# EAGLE schematic STM32-Schematic-Design (EAGLE 9.6.2)

## Sheet 1 of 2
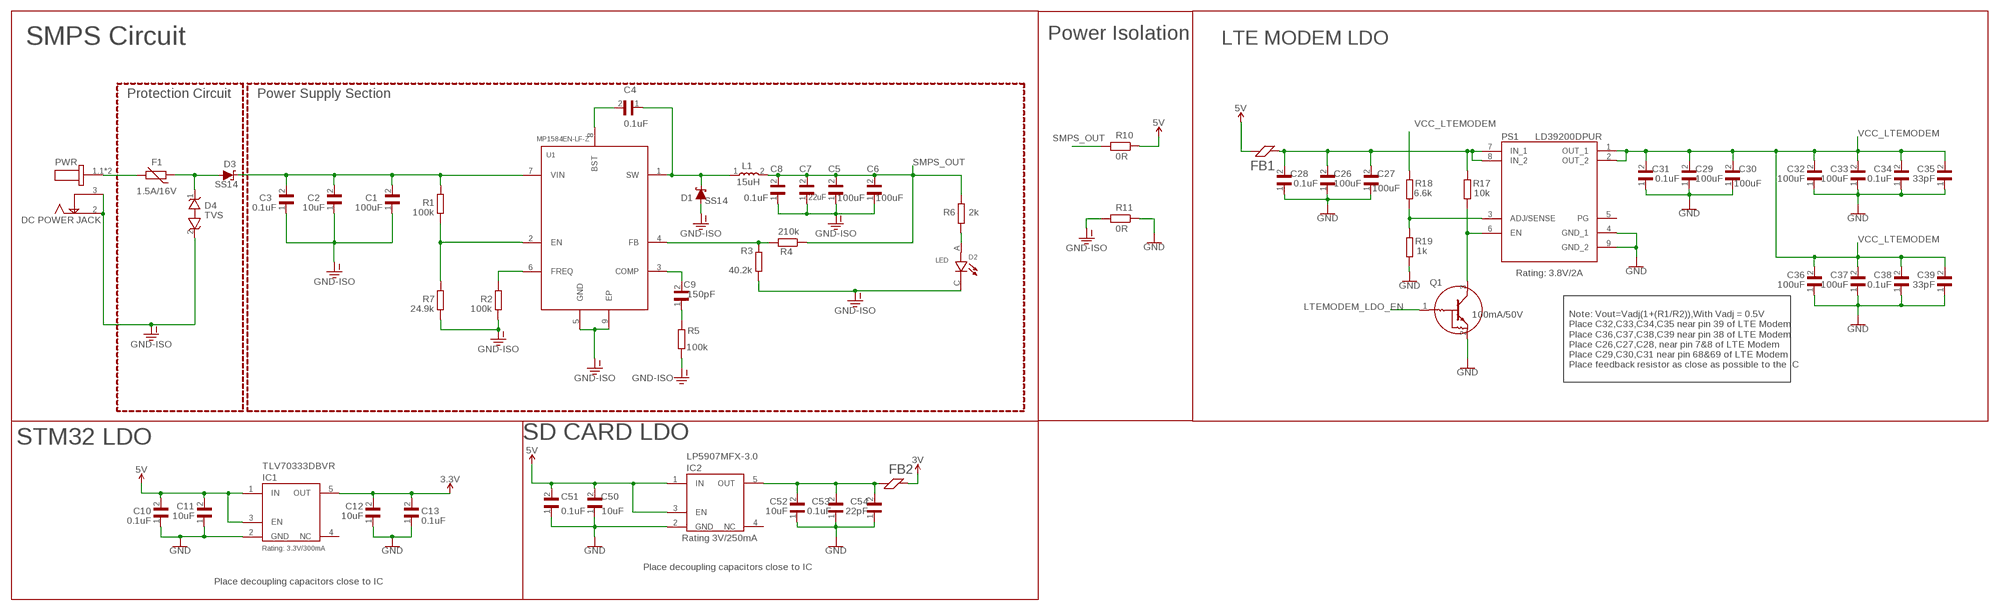
[diagram p0: schematic, sheet 1]

### Parts
C1  100uF  GRM31CR61A107ME05L  [CAPC3216X190N]
C2  10uF  CAPACITOR  [C0603]
C3  0.1uF  CAPACITOR  [C0603]
C4  0.1uF  CAPACITOR  [C0603]
C5  100uF  GRM31CR61A107ME05L  [CAPC3216X190N]
C6  100uF  GRM31CR61A107ME05L  [CAPC3216X190N]
C7  22uF  CAPACITOR  [C0603]
C8  0.1uF  CAPACITOR  [C0603]
C9  150pF  CAPACITOR  [C0603]
C10  0.1uF  CAPACITOR  [C0603]
C11  10uF  CAPACITOR  [C0603]
C12  10uF  CAPACITOR  [C0603]
C13  0.1uF  CAPACITOR  [C0603]
C26  100uF  GRM31CR61A107ME05L  [CAPC3216X190N]
C27  100uF  GRM31CR61A107ME05L  [CAPC3216X190N]
C28  0.1uF  CAPACITOR  [C0603]
C29  100uF  GRM31CR61A107ME05L  [CAPC3216X190N]
C30  100uF  GRM31CR61A107ME05L  [CAPC3216X190N]
C31  0.1uF  CAPACITOR  [C0603]
C32  100uF  GRM31CR61A107ME05L  [CAPC3216X190N]
C33  100uF  GRM31CR61A107ME05L  [CAPC3216X190N]
C34  0.1uF  CAPACITOR  [C0603]
C35  33pF  CAPACITOR  [C0603]
C36  100uF  GRM31CR61A107ME05L  [CAPC3216X190N]
C37  100uF  GRM31CR61A107ME05L  [CAPC3216X190N]
C38  0.1uF  CAPACITOR  [C0603]
C39  33pF  CAPACITOR  [C0603]
C50  10uF  CAPACITOR  [C0603]
C51  0.1uF  CAPACITOR  [C0603]
C52  10uF  CAPACITOR  [C0603]
C53  0.1uF  CAPACITOR  [C0603]
C54  22pF  CAPACITOR  [C0603]
D1  SS14  DIODE-SCHOTTKY-SS14  [SMA-DIODE]
D2  LED  LTW-C191TLA  [LEDC1608X65N]
D3  SS14  DIODE-SCHOTTKY-SS14  [SMA-DIODE]
D4  TVS  SMBJ12CA  [DIONM5436X245N]
F1  1.5A/16V  MINISMDC150F/24-2  [FUSC4632X194N]
FB2  BLM18AG601SZ1D  [BEADC1608X95N]
FL3  FB1  BLM18AG601SZ1D  [BEADC1608X95N]
IC1  TLV70333DBVR  [SOT95P280X145-5N]
IC2  LP5907MFX-3.0  TLV70333DBVR  [SOT95P280X145-5N]
L1  15uH  ASPI-0630LR-150M-T15  [INDPM7266X300N]
PS1  LD39200DPUR  [SON80P400X400X100-9N]
PWR  DC POWER JACK  DCJ200-05-A-XX-X_REVA  [GCT_DCJ200-05-A-XX-X_REVA]
Q1  100mA/50V  DTC143ZET1G  [SOT50P160X90-3N]
R1  100k  RESISTOR  [R0603]
R2  100k  RESISTOR  [R0603]
R3  40.2k  RESISTOR  [R0603]
R4  210k  RESISTOR  [R0603]
R5  100k  RESISTOR  [R0603]
R6  2k  RESISTOR  [R0603]
R7  24.9k  RESISTOR  [R0603]
R10  0R  RC0805FR-7W1K5L  [RESC2012X60]
R11  0R  RC0805FR-7W1K5L  [RESC2012X60]
R17  10k  RESISTOR  [R0603]
R18  6.6k  RESISTOR  [R0603]
R19  1k  RESISTOR  [R0603]
U1  MP1584EN-LF-Z  [SOIC127P600X170-9N]

### Nets
3.3V: C12.2 C13.2 IC1.5(OUT) ; also sheet 2
3V: FB2.2 ; also sheet 2
5V: C10.2 C11.2 C50.2 C51.2 FL3.1 IC1.1(IN) IC1.3(EN) IC2.1(IN) IC2.3(EN) R10.2
GND: C10.1 C11.1 C12.1 C13.1 C26.1 C27.1 C28.1 C29.1 C30.1 C31.1 C32.1 C33.1 C34.1 C35.1 C36.1 C37.1 C38.1 C39.1 C50.1 C51.1 C52.1 C53.1 C54.1 IC1.2(GND) IC2.2(GND) PS1.4(GND_1) PS1.9(GND_2) Q1.2(E) R11.2 R19.1 ; also sheet 2
GND-ISO: C1.1 C2.1 C3.1 C5.1 C6.1 C7.1 C8.1 D1.A D2.C D4.2 PWR.2 PWR.3 R2.1 R3.1 R5.2 R7.1 R11.1 U1.5(GND) U1.9(EP)
LTEMODEM_LDO_EN: Q1.1(B) ; also sheet 2
N$2: R1.1 R7.2 U1.2(EN)
N$3: D3.A D4.1 F1.1
N$4: R2.2 U1.6(FREQ)
N$6: C4.2 U1.8(BST)
N$7: C4.1 D1.C L1.1 U1.1(SW)
N$8: R3.2 R4.2 U1.4(FB)
N$9: C9.2 U1.3(COMP)
N$10: C9.1 R5.1
N$11: D2.A R6.1
N$12: F1.2 PWR.1.1 PWR.1.2
N$70: PS1.6(EN) Q1.3(C) R17.1
N$71: PS1.3(ADJ/SENSE) R18.1 R19.2
N$72: C52.2 C53.2 C54.2 FB2.1 IC2.5(OUT)
N$73: C26.2 C27.2 C28.2 FL3.2 PS1.7(IN_1) PS1.8(IN_2) R17.2
SMPS_IN: C1.2 C2.2 C3.2 D3.C R1.2 U1.7(VIN)
SMPS_OUT: C5.2 C6.2 C7.2 C8.2 L1.2 R4.1 R6.2 R10.1
VCC_LTEMODEM: C29.2 C30.2 C31.2 C32.2 C33.2 C34.2 C35.2 C36.2 C37.2 C38.2 C39.2 PS1.1(OUT_1) PS1.2(OUT_2) R18.2 ; also sheet 2
Unconnected: IC1.4(NC) IC2.4(NC) PS1.5(PG)

### Notes on the sheet
- SMPS Circuit | Power Isolation | LTE MODEM LDO
- Protection Circuit | Power Supply Section
- Rating: 3.8V/2A
- Note: Vout=Vadj(1+(R1/R2)),With Vadj = 0.5V
  Place C32,C33,C34,C35 near pin 39 of LTE Modem
  Place C36,C37,C38,C39 near pin 38 of LTE Modem
  Place C26,C27,C28, near pin 7&8 of LTE Modem
  Place C29,C30,C31 near pin 68&69 of LTE Modem
  Place feedback resistor as close as possible to the IC
- STM32 LDO | SD CARD LDO
- Rating 3V/250mA
- Rating: 3.3V/300mA
- Place decoupling capacitors close to IC
- Place decoupling capacitors close to IC

## Sheet 2 of 2
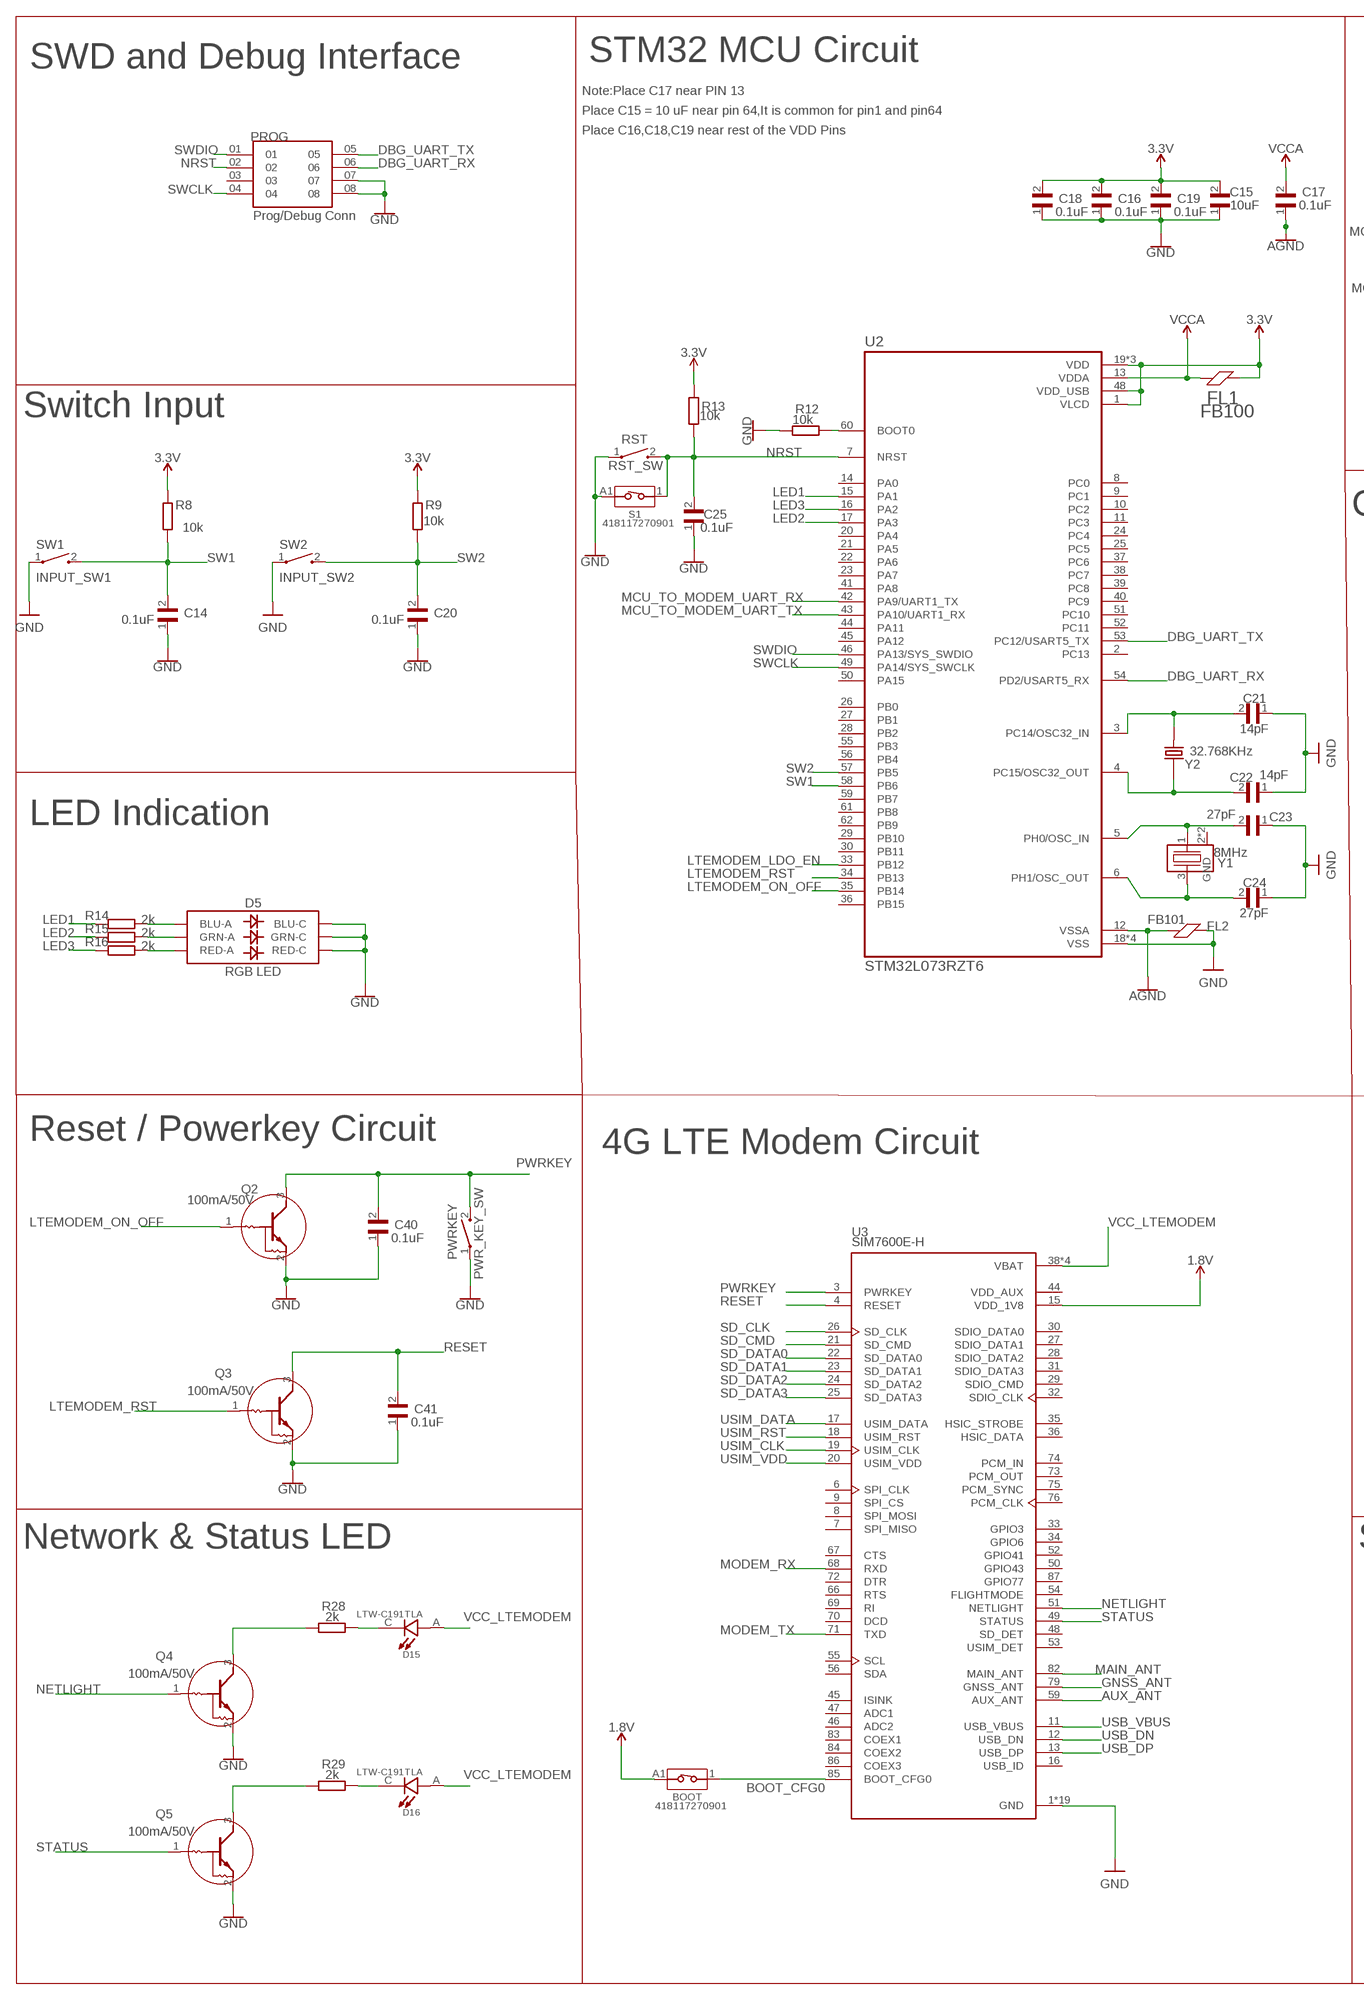
[diagram p1: schematic, sheet 2, part 1 of 2]
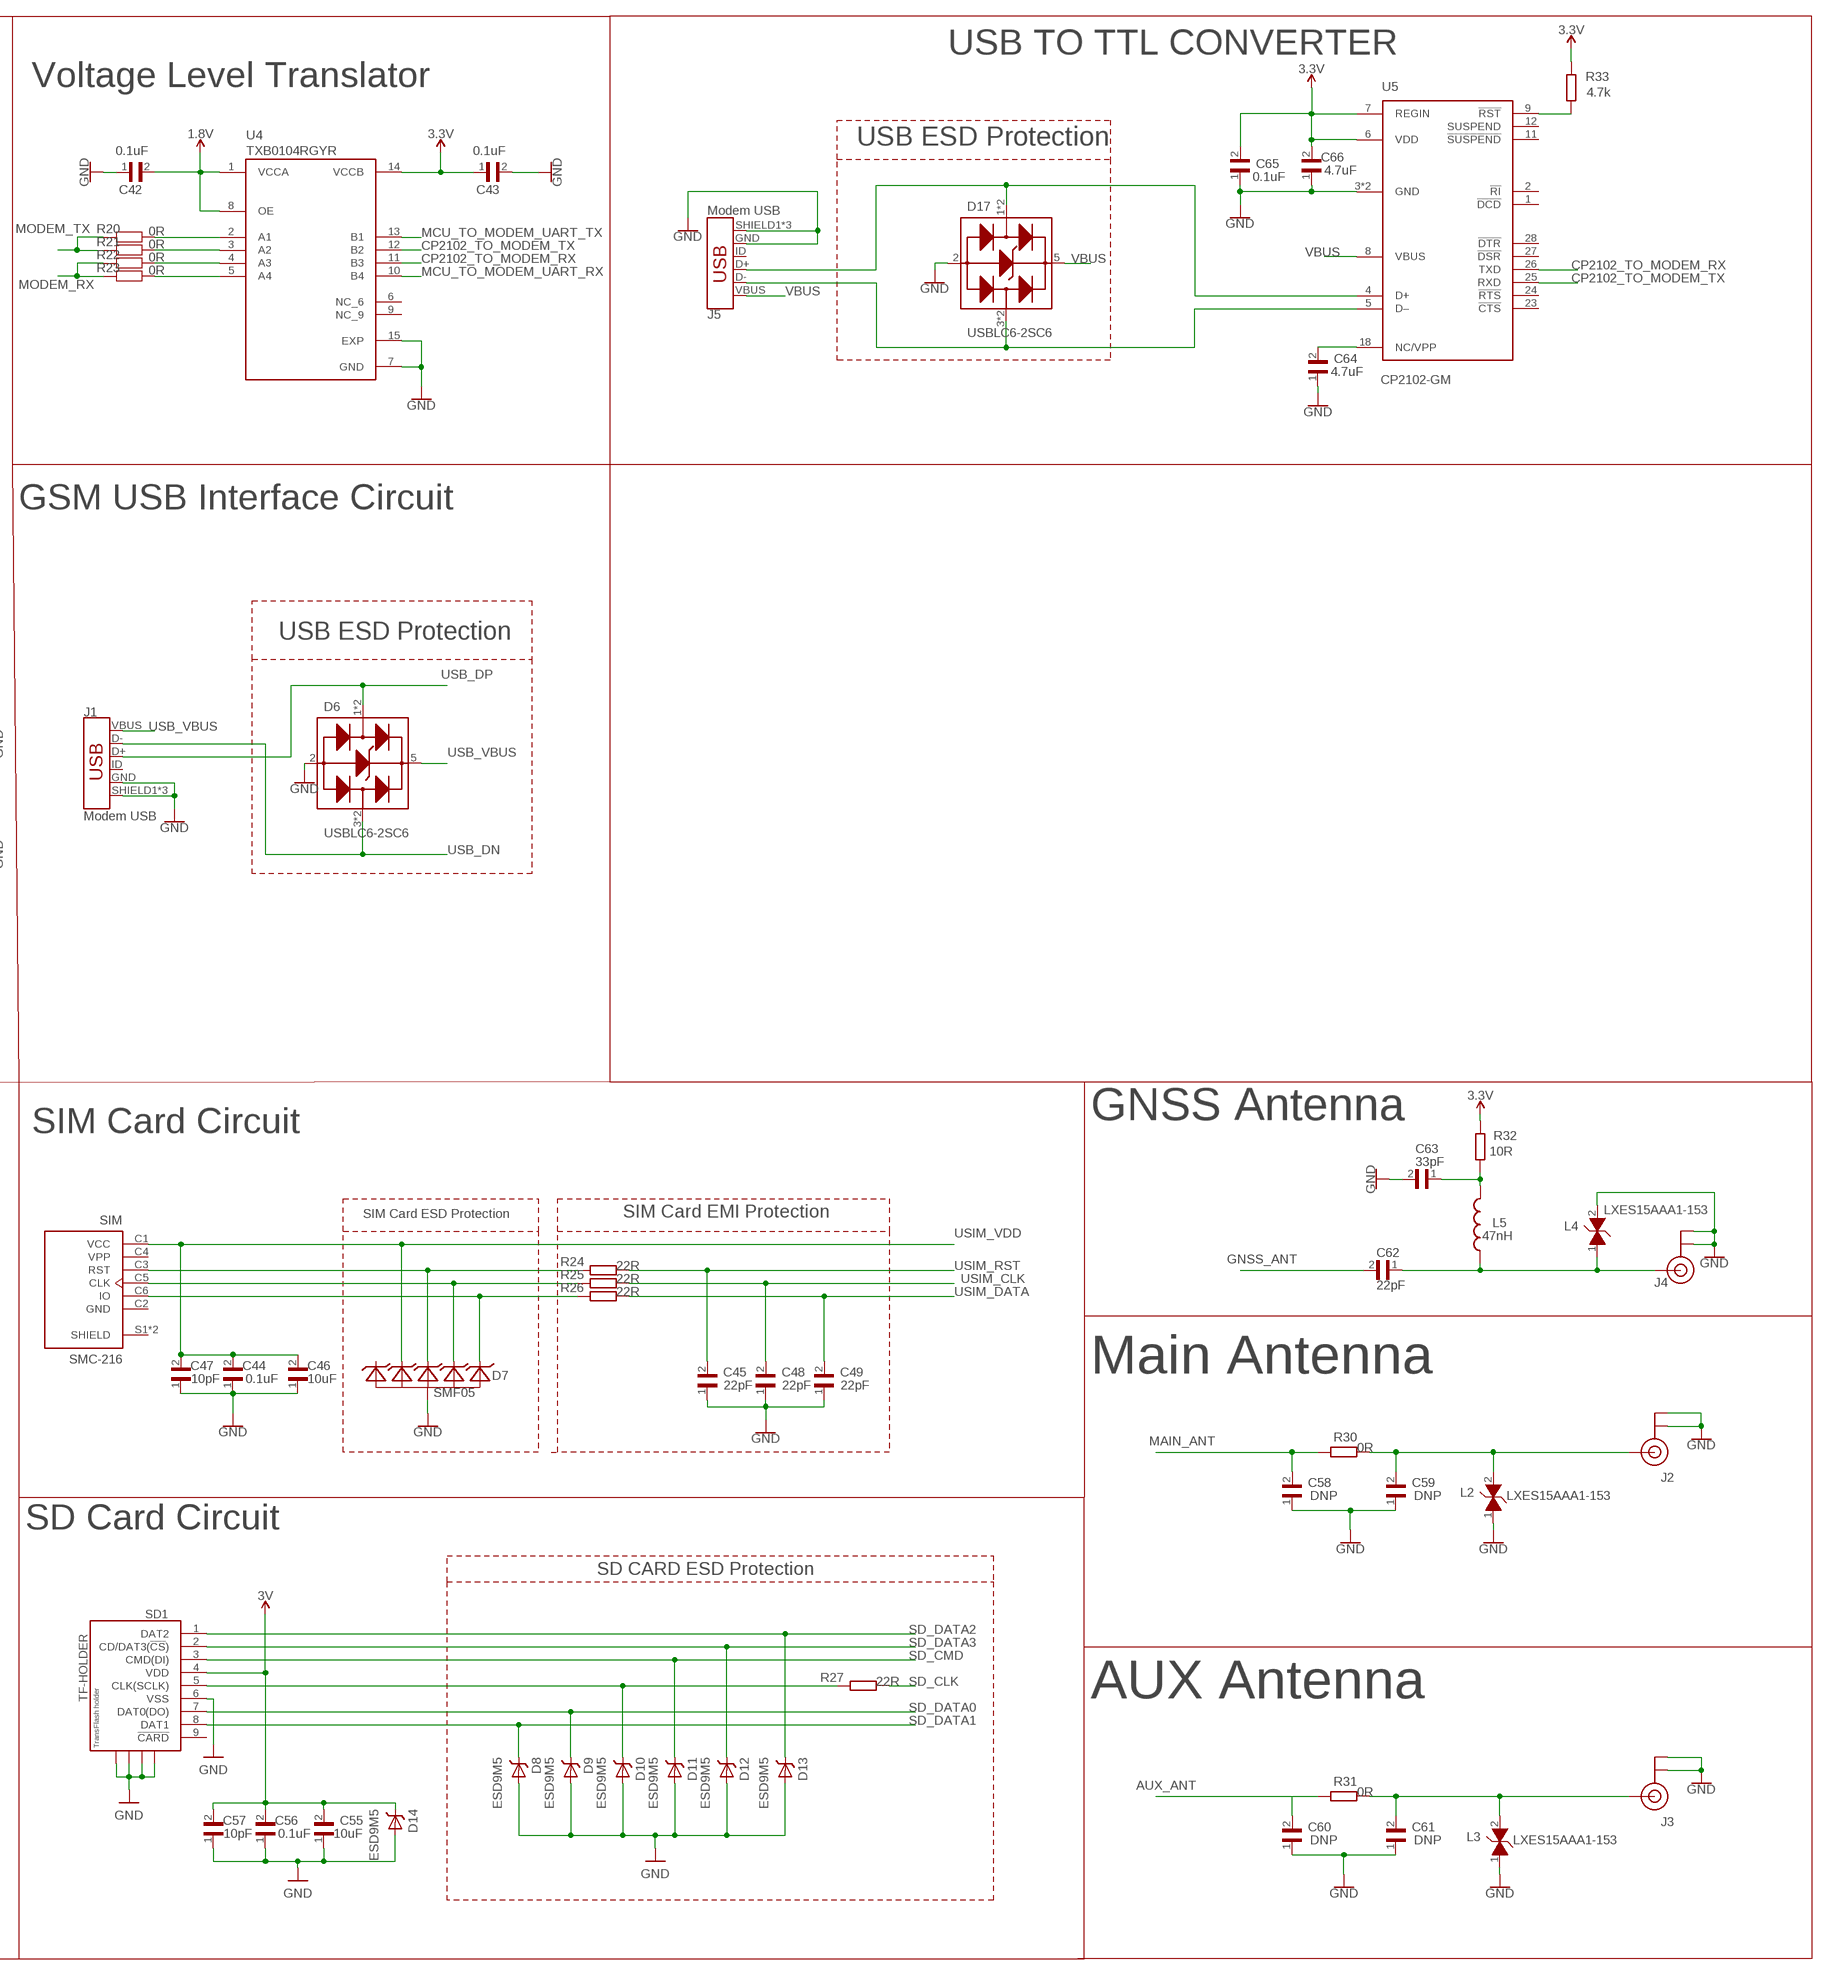
[diagram p2: schematic, sheet 2, part 2 of 2]

### Parts
BOOT  418117270901  [418117270901]
C14  0.1uF  CAPACITOR  [C0603]
C15  10uF  CAPACITOR  [C0603]
C16  0.1uF  CAPACITOR  [C0603]
C17  0.1uF  CAPACITOR  [C0603]
C18  0.1uF  CAPACITOR  [C0603]
C19  0.1uF  CAPACITOR  [C0603]
C20  0.1uF  CAPACITOR  [C0603]
C21  14pF  CAPACITOR  [C0603]
C22  14pF  CAPACITOR  [C0603]
C23  27pF  CAPACITOR  [C0603]
C24  27pF  CAPACITOR  [C0603]
C25  0.1uF  CAPACITOR  [C0603]
C40  0.1uF  CAPACITOR  [C0603]
C41  0.1uF  CAPACITOR  [C0603]
C42  0.1uF  CAPACITOR  [C0603]
C43  0.1uF  CAPACITOR  [C0603]
C44  0.1uF  CAPACITOR  [C0603]
C45  22pF  CAPACITOR  [C0603]
C46  10uF  CAPACITOR  [C0603]
C47  10pF  CAPACITOR  [C0603]
C48  22pF  CAPACITOR  [C0603]
C49  22pF  CAPACITOR  [C0603]
C55  10uF  CAPACITOR  [C0603]
C56  0.1uF  CAPACITOR  [C0603]
C57  10pF  CAPACITOR  [C0603]
C58  DNP  CAPACITOR  [C0603]
C59  DNP  CAPACITOR  [C0603]
C60  DNP  CAPACITOR  [C0603]
C61  DNP  CAPACITOR  [C0603]
C62  22pF  CAPACITOR  [C0603]
C63  33pF  CAPACITOR  [C0603]
C64  4.7uF  CAPACITOR  [C0603]
C65  0.1uF  CAPACITOR  [C0603]
C66  4.7uF  CAPACITOR  [C0603]
D5  RGB LED  LED-RGBNO_IC  [LED-TRICOLOR-5050]
D6  USBLC6-2SC6  [SOT95P280X145-6N]
D7  SMF05  SMF05C.TCT  [SC70-6]
D8  ESD9M5  ESD9M5.0ST5G  [SODFL1060X40N]
D9  ESD9M5  ESD9M5.0ST5G  [SODFL1060X40N]
D10  ESD9M5  ESD9M5.0ST5G  [SODFL1060X40N]
D11  ESD9M5  ESD9M5.0ST5G  [SODFL1060X40N]
D12  ESD9M5  ESD9M5.0ST5G  [SODFL1060X40N]
D13  ESD9M5  ESD9M5.0ST5G  [SODFL1060X40N]
D14  ESD9M5  ESD9M5.0ST5G  [SODFL1060X40N]
D15  LTW-C191TLA  [LEDC1608X65N]
D16  LTW-C191TLA  [LEDC1608X65N]
D17  USBLC6-2SC6  [SOT95P280X145-6N]
FL1  FB100  BLM18AG601SZ1D  [BEADC1608X95N]
FL2  FB101  BLM18AG601SZ1D  [BEADC1608X95N]
J1  Modem USB  USB_MICRO-B_FEMALE-SMT  [USB-B-MICRO-SMD]
J2  U.FL  [U.FL]
J3  U.FL  [U.FL]
J4  U.FL  [U.FL]
J5  Modem USB  USB_MICRO-B_FEMALE-SMT  [USB-B-MICRO-SMD]
L2  LXES15AAA1-153  [INDC1005X45]
L3  LXES15AAA1-153  [INDC1005X45]
L4  LXES15AAA1-153  [INDC1005X45]
L5  47nH  AIML-0603-47NK-T  [INDC1608X95N]
PROG  Prog/Debug Conn  TSM-104-02-S-DV-P  [SAMTEC_TSM-104-02-S-DV-P]
PWRKEY  PWR_KEY_SW  1437566-3  [SW_1437566-3]
Q2  100mA/50V  DTC143ZET1G  [SOT50P160X90-3N]
Q3  100mA/50V  DTC143ZET1G  [SOT50P160X90-3N]
Q4  100mA/50V  DTC143ZET1G  [SOT50P160X90-3N]
Q5  100mA/50V  DTC143ZET1G  [SOT50P160X90-3N]
R8  10k  RESISTOR  [R0603]
R9  10k  RESISTOR  [R0603]
R12  10k  RESISTOR  [R0603]
R13  10k  RESISTOR  [R0603]
R14  2k  RESISTOR  [R0603]
R15  2k  RESISTOR  [R0603]
R16  2k  RESISTOR  [R0603]
R20  0R  RC0402FR-071KL  [RESC1005X40]
R21  0R  RC0402FR-071KL  [RESC1005X40]
R22  0R  RC0402FR-071KL  [RESC1005X40]
R23  0R  RC0402FR-071KL  [RESC1005X40]
R24  22R  RESISTOR  [R0603]
R25  22R  RESISTOR  [R0603]
R26  22R  RESISTOR  [R0603]
R27  22R  RESISTOR  [R0603]
R28  2k  RESISTOR  [R0603]
R29  2k  RESISTOR  [R0603]
R30  0R  RESISTOR  [R0603]
R31  0R  RESISTOR  [R0603]
R32  10R  RESISTOR  [R0603]
R33  4.7k  RESISTOR  [R0603]
RST  RST_SW  1437566-3  [SW_1437566-3]
S1  418117270901  [418117270901]
SD1  TF-HOLDER  [TF-PULL]
SIM  SMC-216  [XUNPU_SMC-216]
SW1  INPUT_SW1  1437566-3  [SW_1437566-3]
SW2  INPUT_SW2  1437566-3  [SW_1437566-3]
U2  STM32L073RZT6  [QFP50P1200X1200X160-64N]
U3  SIM7600E-H  [IC_SIM7600E-H]
U4  TXB0104RGYR  [QFN50P350X350X100-15N]
U5  CP2102-GM  [QFN50P500X500X100-29N]
Y1  8MHz  ABMM2-8.000MHZ-E2-T  [XTAL_ABMM2-8.000MHZ-E2-T]
Y2  32.768KHz  ABS07-32.768KHZ-T  [XTAL_ABS07-32.768KHZ-T]

### Nets
1.8V: BOOT.A1 C42.2 U3.15(VDD_1V8) U4.1(VCCA) U4.8(OE)
3.3V: C15.2 C16.2 C18.2 C19.2 C43.1 C65.2 C66.2 FL1.2 R8.1 R9.1 R13.1 R32.2 R33.1 U2.1(VLCD) U2.19(VDD) U2.32(VDD) U2.48(VDD_USB) U2.64(VDD) U4.14(VCCB) U5.6(VDD) U5.7(REGIN) ; also sheet 1
3V: C55.2 C56.2 C57.2 D14.1 SD1.4(VDD) ; also sheet 1
AGND: C17.1 FL2.1 U2.12(VSSA)
AUX_ANT: C60.2 R31.1 U3.59(AUX_ANT)
BOOT_CFG0: BOOT.1 U3.85(BOOT_CFG0)
CP2102_TO_MODEM_RX: U4.11(B3) U5.26(TXD)
CP2102_TO_MODEM_TX: U4.12(B2) U5.25(RXD)
DBG_UART_RX: PROG.06 U2.54(PD2/USART5_RX)
DBG_UART_TX: PROG.05 U2.53(PC12/USART5_TX)
GND: C14.1 C15.1 C16.1 C18.1 C19.1 C20.1 C21.1 C22.1 C23.1 C24.1 C25.1 C40.1 C41.1 C42.1 C43.2 C44.1 C45.1 C46.1 C47.1 C48.1 C49.1 C55.1 C56.1 C57.1 C58.1 C59.1 C60.1 C61.1 C63.2 C64.1 C65.1 C66.1 D5.4(BLU-C) D5.5(RED-C) D5.6(GRN-C) D6.2(GND) D7.2(A) D8.2 D9.2 D10.2 D11.2 D12.2 D13.2 D14.2 D17.2(GND) FL2.2 J1.GND J1.SHIELD1(SHIELD) J1.SHIELD2(SHIELD) J1.SHIELD3(SHIELD) J2.1(GND) J2.2(GND) J3.1(GND) J3.2(GND) J4.1(GND) J4.2(GND) J5.GND J5.SHIELD1(SHIELD) J5.SHIELD2(SHIELD) J5.SHIELD3(SHIELD) L2.1 L3.1 L4.2 PROG.07 PROG.08 PWRKEY.1 Q2.2(E) Q3.2(E) Q4.2(E) Q5.2(E) R12.1 RST.1 S1.A1 SD1.6(VSS) SD1.S1 SD1.S2 SD1.S3 SD1.S4 SW1.1 SW2.1 U2.18(VSS) U2.31(VSS) U2.47(VSS) U2.63(VSS) U3.1(GND) U3.2(GND) U3.5(GND) U3.10(GND) U3.14(GND) U3.37(GND) U3.40(GND) U3.41(GND) U3.43(GND) U3.57(GND) U3.58(GND) U3.60(GND) U3.61(GND) U3.64(GND) U3.65(GND) U3.77(GND) U3.78(GND) U3.80(GND) U3.81(GND) U4.7(GND) U4.15(EXP) U5.3(GND) U5.29(GND) ; also sheet 1
GNSS_ANT: C62.2 U3.79(GNSS_ANT)
LED1: R14.1 U2.15(PA1)
LED2: R15.1 U2.17(PA3)
LED3: R16.1 U2.16(PA2)
LTEMODEM_LDO_EN: U2.33(PB12) ; also sheet 1
LTEMODEM_ON_OFF: Q2.1(B) U2.35(PB14)
LTEMODEM_RST: Q3.1(B) U2.34(PB13)
MAIN_ANT: C58.2 R30.1 U3.82(MAIN_ANT)
MCU_TO_MODEM_UART_RX: U2.42(PA9/UART1_TX) U4.10(B4)
MCU_TO_MODEM_UART_TX: U2.43(PA10/UART1_RX) U4.13(B1)
MODEM_RX: R22.1 R23.1 U3.68(RXD)
MODEM_TX: R20.1 R21.1 U3.71(TXD)
N$1: D17.1(I/O1) D17.6(I/O1) J5.D+ U5.4(D+)
N$5: D17.3(I/O2) D17.4(I/O2) J5.D- U5.5(D–)
N$13: R33.2 U5.9(!RST)
N$15: C64.2 U5.18(NC/VPP)
N$60: R12.2 U2.60(BOOT0)
N$61: C21.2 U2.3(PC14/OSC32_IN) Y2.2
N$62: C22.2 U2.4(PC15/OSC32_OUT) Y2.1
N$63: C23.2 U2.5(PH0/OSC_IN) Y1.1
N$64: C24.2 U2.6(PH1/OSC_OUT) Y1.3
N$65: D5.3(BLU-A) R14.2
N$66: D5.1(GRN-A) R15.2
N$67: D5.2(RED-A) R16.2
N$74: D7.4(C3) R24.1 SIM.C3(RST)
N$75: D7.5(C4) R25.1 SIM.C5(CLK)
N$76: R21.2 U4.3(A2)
N$77: R20.2 U4.2(A1)
N$78: D7.6(C5) R26.1 SIM.C6(IO)
N$79: R22.2 U4.4(A3)
N$80: R23.2 U4.5(A4)
N$81: Q4.3(C) R28.1
N$82: Q5.3(C) R29.1
N$83: D10.1 R27.1 SD1.5(CLK(SCLK))
N$84: D16.C R29.2
N$85: D15.C R28.2
N$86: C63.1 L5.2 R32.1
N$87: C59.2 J2.FEED(SIGNAL) L2.2 R30.2
N$88: C61.2 J3.FEED(SIGNAL) L3.2 R31.2
N$89: C62.1 J4.FEED(SIGNAL) L4.1 L5.1
NETLIGHT: Q4.1(B) U3.51(NETLIGHT)
NRST: C25.2 PROG.02 R13.2 RST.2 S1.1 U2.7(NRST)
PWRKEY: C40.2 PWRKEY.2 Q2.3(C) U3.3(PWRKEY)
RESET: C41.2 Q3.3(C) U3.4(RESET)
SD_CLK: R27.2 U3.26(SD_CLK)
SD_CMD: D11.1 SD1.3(CMD(DI)) U3.21(SD_CMD)
SD_DATA0: D9.1 SD1.7(DAT0(DO)) U3.22(SD_DATA0)
SD_DATA1: D8.1 SD1.8(DAT1) U3.23(SD_DATA1)
SD_DATA2: D13.1 SD1.1(DAT2) U3.24(SD_DATA2)
SD_DATA3: D12.1 SD1.2(CD/DAT3(!CS!)) U3.25(SD_DATA3)
STATUS: Q5.1(B) U3.49(STATUS)
SW1: C14.2 R8.2 SW1.2 U2.58(PB6)
SW2: C20.2 R9.2 SW2.2 U2.57(PB5)
SWCLK: PROG.04 U2.49(PA14/SYS_SWCLK)
SWDIO: PROG.01 U2.46(PA13/SYS_SWDIO)
USB_DN: D6.3(I/O2) D6.4(I/O2) J1.D- U3.12(USB_DN)
USB_DP: D6.1(I/O1) D6.6(I/O1) J1.D+ U3.13(USB_DP)
USB_VBUS: D6.5(VBUS) J1.VBUS U3.11(USB_VBUS)
USIM_CLK: C48.2 R25.2 U3.19(USIM_CLK)
USIM_DATA: C49.2 R26.2 U3.17(USIM_DATA)
USIM_RST: C45.2 R24.2 U3.18(USIM_RST)
USIM_VDD: C44.2 C46.2 C47.2 D7.3(C2) SIM.C1(VCC) U3.20(USIM_VDD)
VBUS: D17.5(VBUS) J5.VBUS U5.8(VBUS)
VCC_LTEMODEM: D15.A D16.A U3.38(VBAT) U3.39(VBAT) U3.62(VBAT) U3.63(VBAT) ; also sheet 1
VCCA: C17.2 FL1.1 U2.13(VDDA)
Unconnected: D7.1(C1) J1.ID J5.ID PROG.03 SD1.9(!CARD) SIM.S1(SHIELD) SIM.S2(SHIELD) U2.2(PC13) U2.8(PC0) U2.9(PC1) U2.10(PC2) U2.11(PC3) U2.14(PA0) U2.20(PA4) U2.21(PA5) U2.22(PA6) U2.23(PA7) U2.24(PC4) U2.25(PC5) U2.26(PB0) U2.27(PB1) U2.28(PB2) U2.29(PB10) U2.30(PB11) U2.36(PB15) U2.37(PC6) U2.38(PC7) U2.39(PC8) U2.40(PC9) U2.41(PA8) U2.44(PA11) U2.45(PA12) U2.50(PA15) U2.51(PC10) U2.52(PC11) U2.55(PB3) U2.56(PB4) U2.59(PB7) U2.61(PB8) U2.62(PB9) U3.6(SPI_CLK) U3.7(SPI_MISO) U3.8(SPI_MOSI) U3.9(SPI_CS) U3.16(USB_ID) U3.27(SDIO_DATA1) U3.28(SDIO_DATA2) U3.29(SDIO_CMD) U3.30(SDIO_DATA0) U3.31(SDIO_DATA3) U3.32(SDIO_CLK) U3.33(GPIO3) U3.34(GPIO6) U3.35(HSIC_STROBE) U3.36(HSIC_DATA) U3.44(VDD_AUX) U3.45(ISINK) U3.46(ADC2) U3.47(ADC1) U3.48(SD_DET) U3.50(GPIO43) U3.52(GPIO41) U3.53(USIM_DET) U3.54(FLIGHTMODE) U3.55(SCL) U3.56(SDA) U3.66(RTS) U3.67(CTS) U3.69(RI) U3.70(DCD) U3.72(DTR) U3.73(PCM_OUT) U3.74(PCM_IN) U3.75(PCM_SYNC) U3.76(PCM_CLK) U3.83(COEX1) U3.84(COEX2) U3.86(COEX3) U3.87(GPIO77) U4.6(NC_6) U4.9(NC_9) U5.1(!DCD) U5.2(!RI) U5.11(!SUSPEND) U5.12(SUSPEND) U5.23(!CTS) U5.24(!RTS) U5.27(!DSR) U5.28(!DTR)

### Notes on the sheet
- STM32 MCU Circuit | USB TO TTL CONVERTER
- SWD and Debug Interface
- Voltage Level Translator
- Note:Place C17 near PIN 13
- Place C15 = 10 uF near pin 64,It is common for pin1 and pin64
- Place C16,C18,C19 near rest of the VDD Pins
- USB ESD Protection
- Switch Input
- GSM USB Interface Circuit
- USB ESD Protection
- LED Indication
- Reset / Powerkey Circuit | GNSS Antenna
- 4G LTE Modem Circuit | SIM Card Circuit
- SIM Card ESD Protection | SIM Card EMI Protection
- Main Antenna
- Network & Status LED | SD Card Circuit
- SD CARD ESD Protection
- AUX Antenna

## Power pins joined to a net without a drawn wire
GND: SIM.C2(GND) Y1.2(GND) Y1.4(GND)
VPP: SIM.C4(VPP)

## Library data of the parts
BOOT S1 = PC_Switch_DIP:418117270901: WS-DITV Compact THT with Raised Actuator 2.54 mm Mechanical Properties Operation Force:800 g Electrical Life:2000 Cycles Actuator Type:Raise Type Properties IR:25 mA VR:24 V (DC) IR:100 mA VR:50 V (DC) Contact Resistance Initial:50 mΩ Contact Resistance After Life Test:100 mΩ RISO:100 MΩ Withstanding Voltage:500 V (AC) Actuator Type:Raise Type Switch Position:Off Material Properties Cover Material:PBT Cover Flammability Rating:UL94 V-0 Cover Color:Red Base Material:PBT Base Flammability Rating:UL94 V-0 Base Color:Black Actuator Material:PBT Actuator Flammability Rating:UL94 V-0 Actuator Color:White Contact Material:Copper Alloy Contact Plating:Gold Terminal Material:Copper Alloy Terminal Plating:Gold General Information Operating Temperature:-40 up to +85 °C Packaging Properties Packaging:Tube <https://www.we-online.com/catalog/media/o60896v209%20DITV_418117270908A_gruppe.jpg> Details see: https://www.we-online.com/catalog/en/DITV_2_54_COMPACT_THT_WITH_RAISED_ACTUATOR/ Updated by Yingchun, Shan 2020-01-22 2020 (C) Würth Elektronik Check prices <https://pricing.snapeda.com/parts/418117270901/Wurth%20Electronics/view-part?ref=eda>; AVAILABILITY: Bad; DESCRIPTION: Dip Switch SPST 1 Position Through Hole Slide (Standard) Actuator 25mA 24VDC; MF: Wurth Electronics; MP: 418117270901; PACKAGE: None; PRICE: None
C1 C5 C6 C26 C27 C29 C30 C32 C33 C36 C37 = PC_Capacitor_1206:GRM31CR61A107ME05L: KC 100ÂµF 1206 20% 10V X5R RoHScon Check prices <https://pricing.snapeda.com/parts/GRM31CR61A107ME05L/Murata/view-part?ref=eda>; AVAILABILITY: Warning; DESCRIPTION: SMD Capacitor X5R(EIA) with Capacitance: 100uF Tol. 20%. Rated Voltage: 10Vdc; MF: Murata; MP: GRM31CR61A107ME05L; PACKAGE: 3216 Murata; PRICE: None; PURCHASE-URL: https://pricing.snapeda.com/search/part/GRM31CR61A107ME05L/?ref=eda
C2-C4 C7-C25 C28 C31 C34 C35 C38-C66 = PC_Capacitor_0603:CAPACITOR: CAP CERAMIC, 0.1UF, 50V, X7R, 0603, FULL REEL Check prices <https://pricing.snapeda.com/parts/CGA3E2X7R1H104K080AA/TDK/view-part?ref=eda>; AVAILABILITY: Good; DESCRIPTION: 0.1µF ±10% 50V Ceramic Capacitor X7R 0603 (1608 Metric); MF: TDK; MP: CGA3E2X7R1H104K080AA; PACKAGE: 1608 TDK; PRICE: None; PURCHASE-URL: https://pricing.snapeda.com/search/part/CGA3E2X7R1H104K080AA/?ref=eda
D1 D3 = SparkFun-DiscreteSemi:DIODE-SCHOTTKY: Schottky diode A Schottky diode is a semiconductor diode which has a low forward voltage drop and a very fast switching action.; PROD_ID: DIO-08053; VALUE: 1A/40V/500mV
D2 D15 D16 = PC_LED_0603:LTW-C191TLA: CHIP LED WHITE 0603 TOP VIEW Check prices <https://pricing.snapeda.com/parts/LTW-C191TLA/Lite-On/view-part?ref=eda>; AVAILABILITY: Warning; DESCRIPTION: White LED Indication - Discrete 3.1V 0603 (1608 Metric); MF: Lite-On; MP: LTW-C191TLA; PACKAGE: 0603 Lite-On; PRICE: None; PURCHASE-URL: https://pricing.snapeda.com/search/part/LTW-C191TLA/?ref=eda
D4 = PC_Diode_SMBJ12CA:SMBJ12CA: TAIWAN SEMICONDUCTOR - SMBJ12CA - DIODE, TVS, 12V, 600W, SMB Source: Datasheet <https://componentsearchengine.com/Datasheets/2/SMBJ12CA.pdf>; ARROW_PART_NUMBER: SMBJ12CA; ARROW_PRICE-STOCK: https://www.arrow.com/en/products/smbj12ca/taiwan-semiconductor; DESCRIPTION: TAIWAN SEMICONDUCTOR - SMBJ12CA - DIODE, TVS, 12V, 600W, SMB; HEIGHT: 2.45mm; MANUFACTURER_NAME: Taiwan Semiconductor; MANUFACTURER_PART_NUMBER: SMBJ12CA; MOUSER_PART_NUMBER: 821-SMBJ12CA; MOUSER_PRICE-STOCK: https://www.mouser.co.uk/ProductDetail/Taiwan-Semiconductor/SMBJ12CA/?qs=tHU%2FlV7kTyRAeZbjda26tQ%3D%3D
D5 = SparkFun-LED:LED-RGB: LED-RGB 6 pin RGB LED (no common connector) Packages: PLCC-6 LED-TRICOLOR-5050 - No built-in IC SparkFun Products: Digital Sandbox <https://www.sparkfun.com/products/12651> LED- SMD RGB <https://www.sparkfun.com/products/10866>; PROD_ID: DIO-10298
D6 D17 = PC_IC_USBLC6-2SC6:USBLC6-2SC6: 17V Clamp 5A (8/20µs) Ipp Tvs Diode Surface Mount SOT-23-6 Check prices <https://pricing.snapeda.com/parts/USBLC6-2SC6/STMicroelectronics/view-part?ref=eda>; AVAILABILITY: Good; DESCRIPTION: 17V Clamp 5A (8/20µs) Ipp Tvs Diode Surface Mount SOT-23-6; MF: STMicroelectronics; MP: USBLC6-2SC6; PACKAGE: SOT-23-6 STMicroelectronics; PRICE: None; PURCHASE-URL: https://pricing.snapeda.com/search/part/USBLC6-2SC6/?ref=eda
D7 = PC_IC_SMF05C.TCT:SMF05C.TCT: Check prices <https://pricing.snapeda.com/parts/SMF05C.TCT/Semtech/view-part?ref=eda>; AVAILABILITY: Warning; DESCRIPTION: 12.5V Clamp 8A (8/20µs) Ipp Tvs Diode Surface Mount SC-70-6; MF: Semtech; MP: SMF05C.TCT; PACKAGE: SOT-363 Diodes Inc.; PRICE: None; PURCHASE-URL: https://pricing.snapeda.com/search/part/SMF05C.TCT/?ref=eda
D8-D14 = PC_Diode_ESD9M50ST5G:ESD9M5.0ST5G: Low Capacitance ESD Protection; Unidirectional Check prices <https://pricing.snapeda.com/parts/ESD9M5.0ST5G/ON%20Semiconductor/view-part?ref=eda>; AVAILABILITY: Good; DESCRIPTION: 9.8V Clamp 1A (8/20µs) Ipp Tvs Diode Surface Mount SOD-923; MF: ON Semiconductor; MP: ESD9M5.0ST5G; PACKAGE: SOD-923-2 ON Semiconductor; PRICE: None; PURCHASE-URL: https://pricing.snapeda.com/search/part/ESD9M5.0ST5G/?ref=eda
F1 = PC_Fuse_MINISMDC150F_24-2:MINISMDC150F/24-2: Polymeric PTC Resettable Fuse 24V 1.5A Ih Surface Mount 1812 (4532 Metric), Concave Check prices <https://pricing.snapeda.com/parts/MINISMDC150F/24-2/TE%20Connectivity/view-part?ref=eda>; AVAILABILITY: Good; DESCRIPTION: PTC Resettable Fuse 1.5A(hold) 3A(trip) 24VDC 20A 1W 1.5s 0.04Ohm SMD Solder Pad 4.83 X 3.41 X 1.94mm T/R Automotive; MF: TE Connectivity; MP: MINISMDC150F/24-2; PACKAGE: None; PRICE: None; PURCHASE-URL: https://pricing.snapeda.com/search/part/MINISMDC150F/24-2/?ref=eda
FB2 FL1-FL3 = PC_FerriteBead_BLM18AG601SZ1D:BLM18AG601SZ1D: Ferrite Beads Multi-Layer 600Ohm 25% 100MHz 500mA 380mOhm DCR 0603 Automotive T/R Check prices <https://pricing.snapeda.com/parts/BLM18AG601SZ1D/Murata/view-part?ref=eda>; AVAILABILITY: Good; DESCRIPTION: 600 Ohms @ 100MHz 1 Signal Line Ferrite Bead 0603 (1608 Metric) 500mA 380mOhm; MF: Murata; MP: BLM18AG601SZ1D; PACKAGE: 1608 Murata; PRICE: None; PURCHASE-URL: https://pricing.snapeda.com/search/part/BLM18AG601SZ1D/?ref=eda
IC1 IC2 = PC_IC_TLV70333DBVR:TLV70333DBVR: 300mA Low-IQ Low-Dropout (LDO) Regulator Source: Datasheet <http://www.ti.com/lit/gpn/tlv703>; ARROW_PART_NUMBER: TLV70333DBVR; ARROW_PRICE-STOCK: https://www.arrow.com/en/products/tlv70333dbvr/texas-instruments; DESCRIPTION: 300mA Low-IQ Low-Dropout (LDO) Regulator; HEIGHT: 1.45mm; MANUFACTURER_NAME: Texas Instruments; MANUFACTURER_PART_NUMBER: TLV70333DBVR; MOUSER_PART_NUMBER: 595-TLV70333DBVR; MOUSER_PRICE-STOCK: https://www.mouser.co.uk/ProductDetail/Texas-Instruments/TLV70333DBVR?qs=u4fy%2FsgLU9PpWywgVkWnzw%3D%3D
J1 J5 = SparkFun-Connectors:USB_MICRO-B: USB Type Micro-B Connector Male/female and PTH/SMT variants SparkFun Products: SparkFun microB USB Breakout <https://www.sparkfun.com/products/12035> SparkFun USB microB Plug Breakout <https://www.sparkfun.com/products/10031> SparkFun ESP8266 Thing <https://www.sparkfun.com/products/13231>; PROD_ID: CONN-11752
J2-J4 = SparkFun-Connectors:U.FL: SMD Antenna Connector - U.FL 2mm height, 3.0mm x 3.0mm receptacle size. SparkFun Products: SparkFun WiFi Shield - ESP8266 <https://www.sparkfun.com/products/13287> SparkFun ESP8266 Thing <https://www.sparkfun.com/products/13231> SparkFun MiniGen - Pro Mini Signal Generator Shield <https://www.sparkfun.com/products/11420>; PROD_ID: CONN-09193; SF_ID: WRL-09144
L1 = PC_Inductor_15uH:ASPI-0630LR-150M-T15: Fixed Inductors 15 UH 20% Source: Datasheet <https://abracon.com/Magnetics/power/ASPI-0630LR.pdf>; ARROW_PART_NUMBER: ASPI-0630LR-150M-T15; ARROW_PRICE-STOCK: https://www.arrow.com/en/products/aspi-0630lr-150m-t15/abracon; DESCRIPTION: Fixed Inductors 15 UH 20%; HEIGHT: 3mm; MANUFACTURER_NAME: ABRACON; MANUFACTURER_PART_NUMBER: ASPI-0630LR-150M-T15; MOUSER_PART_NUMBER: 815-ASPI0630LR150T15; MOUSER_PRICE-STOCK: https://www.mouser.co.uk/ProductDetail/ABRACON/ASPI-0630LR-150M-T15/?qs=bWAYEm3xoCYKmwZKzI2%2F7Q%3D%3D
L2-L4 = PC_Diode_TVS_LXES15AAA1-153:LXES15AAA1-153: TVS DIODE 4VWM 0402 Check prices <https://pricing.snapeda.com/parts/LXES15AAA1-153/Murata/view-part?ref=eda>; AVAILABILITY: Good; DESCRIPTION: Clamp Ipp Tvs Diode Surface Mount 1005; MF: Murata; MP: LXES15AAA1-153; PACKAGE: 0402 Murata; PRICE: None; PURCHASE-URL: https://pricing.snapeda.com/search/part/LXES15AAA1-153/?ref=eda
L5 = PC_Inductor_0603:AIML-0603-47NK-T: FIXED IND 47NH 50MA 200 MOHM SMD Check prices <https://pricing.snapeda.com/parts/AIML-0603-47NK-T/Abracon/view-part?ref=eda>; AVAILABILITY: Warning; DESCRIPTION: 47nH Shielded Multilayer Inductor 50mA 200mOhm Max 0603 (1608 Metric); MF: Abracon; MP: AIML-0603-47NK-T; PACKAGE: 1608 Taiyo Yuden; PRICE: None; PURCHASE-URL: https://pricing.snapeda.com/search/part/AIML-0603-47NK-T/?ref=eda
PROG = PC_Header_2_54mm_8_POS:TSM-104-02-S-DV-P: Check prices <https://pricing.snapeda.com/parts/TSM-104-02-S-DV-P/Samtec/view-part?ref=eda>; AVAILABILITY: Bad; DESCRIPTION: Conn Unshrouded Header HDR 8 POS 2.54mm Solder ST SMD Tube; MF: Samtec; MP: TSM-104-02-S-DV-P; PACKAGE: None; PRICE: None; PURCHASE-URL: https://pricing.snapeda.com/search/part/TSM-104-02-S-DV-P/?ref=eda
PS1 = PC_LDO_LD39200DPUR:LD39200DPUR: LDO Voltage Regulators Linear Voltage Regulators & Vref Source: Datasheet <https://componentsearchengine.com/Datasheets/1/LD39200DPUR.pdf>; ARROW_PART_NUMBER: LD39200DPUR; ARROW_PRICE-STOCK: https://www.arrow.com/en/products/ld39200dpur/stmicroelectronics; DESCRIPTION: LDO Voltage Regulators Linear Voltage Regulators & Vref; HEIGHT: 1mm; MANUFACTURER_NAME: STMicroelectronics; MANUFACTURER_PART_NUMBER: LD39200DPUR; MOUSER_PART_NUMBER: 511-LD39200DPUR; MOUSER_PRICE-STOCK: https://www.mouser.co.uk/ProductDetail/STMicroelectronics/LD39200DPUR/?qs=BNh1ct5PoGR12uqpHRZU9g%3D%3D
PWR = PC_CON_DC_Power_Jack:DCJ200-05-A-XX-X_REVA: DC Power Jack, SMT, Horizontal, with Locating Pegs, D2.0mm Check prices <https://pricing.snapeda.com/parts/DCJ200-05-A-K1-A/Global%20Connector%20Technology/view-part?ref=eda>; AVAILABILITY: Warning; DESCRIPTION: Power Barrel Connector Jack 2.05mm ID (0.081), 5.50mm OD (0.217) Surface Mount, Right Angle; MF: Global Connector Technology; MP: DCJ200-05-A-K1-A; PACKAGE: None; PRICE: None; PURCHASE-URL: https://pricing.snapeda.com/search/part/DCJ200-05-A-K1-A/?ref=eda
PWRKEY RST SW1 SW2 = PC_Switch_1437566-3:1437566-3: Switch Tactile OFF (ON) SPST Rectangular Button Gull Wing 0.05A 12VDC SMD Loose Piece Check prices <https://pricing.snapeda.com/parts/1437566-3/TE%20Connectivity/view-part?ref=eda>; AVAILABILITY: Good; COMMENT: 1437566-3; CONFIGURATION_POLE-THROW: Single Pole - Single Throw; CONTACT_CURRENT_RATING: 50 mA; DESCRIPTION: Tactile Switch SPST-NO Top Actuated Surface Mount; MF: TE Connectivity; MP: 1437566-3; PACKAGE: None; PRICE: None
Q1-Q5 = PC_IC_DTC143ZET1G:DTC143ZET1G: ON Semiconductor, DTC143ZET1G NPN Digital Transistor, 100 mA 50 V 4.7 k, Ratio Of 0.1, 3-Pin SC-75 Source: Datasheet <http://www.onsemi.com/pub/Collateral/DTC143Z-D.PDF>; ARROW_PART_NUMBER: DTC143ZET1G; ARROW_PRICE-STOCK: https://www.arrow.com/en/products/dtc143zet1g/on-semiconductor; DESCRIPTION: ON Semiconductor, DTC143ZET1G NPN Digital Transistor, 100 mA 50 V 4.7 k, Ratio Of 0.1, 3-Pin SC-75; HEIGHT: 0.9mm; MANUFACTURER_NAME: ON Semiconductor; MANUFACTURER_PART_NUMBER: DTC143ZET1G; MOUSER_PART_NUMBER: 863-DTC143ZET1G; MOUSER_PRICE-STOCK: https://www.mouser.co.uk/ProductDetail/ON-Semiconductor/DTC143ZET1G/?qs=2OtswVQKCOGWcFMBzaldrg%3D%3D
R1-R9 R12-R19 R24-R33 = PC_Resistor_0603:RESISTOR; MF: Yageo; RESISTOR: 0603
R10 R11 = PC_Resistor_0805:RC0805FR-7W1K5L: RC Series 0805 0.125 W 2 kOhms 5% ±100 ppm/°C SMT Thick Film Chip Resistor Check prices <https://pricing.snapeda.com/parts/RC0805FR-7W1K5L/Yageo/view-part?ref=eda>; AVAILABILITY: Warning; DESCRIPTION: Thick Film Resistors - SMD; MF: Yageo; MP: RC0805FR-7W1K5L; PACKAGE: 0805 Yageo; PRICE: None; PURCHASE-URL: https://pricing.snapeda.com/search/part/RC0805FR-7W1K5L/?ref=eda
R20-R23 = PC_Resistor_0402:RC0402FR-071KL: RC Series 0402 0.063 W 1 kOhms ±1% ±100 ppm/°C SMT Thick Film Chip Resistor Check prices <https://pricing.snapeda.com/parts/RC0402FR-071KL/Yageo/view-part?ref=eda>; AVAILABILITY: Good; DESCRIPTION: 1 kOhms ±1% 0.063W, 1/16W Chip Resistor 0402 (1005 Metric) Moisture Resistant Thick Film; MF: Yageo; MP: RC0402FR-071KL; PACKAGE: 0402 Samtec; PRICE: None; PURCHASE-URL: https://pricing.snapeda.com/search/part/RC0402FR-071KL/?ref=eda
SD1 = PC_Holder_SD_Card:TF-HOLDER: TF / Micro SD socket is PUSH-PUSH type, the card can be pushed into and auto locked and pushed out by simply press the card. Surface Mounting type.
SIM = PC_Holder_SMC-216:SMC-216: Micro Sim Connector; AVAILABILITY: Unavailable; DESCRIPTION: Micro Sim Connector; MF: Xunpu; MP: SMC-216; PACKAGE: Package; PRICE: None
U1 = PC_IC_MP1584EN:MP1584EN-LF-Z: The MP1584 is a high frequency step-down switching regulator with an integrated internal high-side high voltage power MOSFET. It provides 3A output with current mode control for fast loop response and easy compensation. The wide 4.5V to 28V input range accommodates a variety of step-down applications, including those in an automotive input environment. A 100µA operational quiescent current allows use in battery-powered applications. Check prices <https://pricing.snapeda.com/parts/MP1584EN-LF-Z/Monolithic%20Power/view-part?ref=eda>; AVAILABILITY: Warning; DESCRIPTION: Buck Switching Regulator IC Positive Adjustable 0.8V 1 Output 3A 8-SOIC (0.154, 3.90mm Width) Exposed Pad; MF: Monolithic Power; MP: MP1584EN-LF-Z; PACKAGE: SOIC-8 MPS; PRICE: None; PURCHASE-URL: https://pricing.snapeda.com/search/part/MP1584EN-LF-Z/?ref=eda
U2 = PC_IC_STM32L073RZT6:STM32L073RZT6: None Check prices <https://pricing.snapeda.com/parts/STM32L073RZT6/STMicroelectronics/view-part?ref=eda>; AVAILABILITY: Good; DESCRIPTION: ARM® Cortex®-M0+ STM32L0 Microcontroller IC 32-Bit 32MHz 192KB (192K x 8) FLASH 64-LQFP (10x10); MF: STMicroelectronics; MP: STM32L073RZT6; PACKAGE: LQFP-64 STMicroelectronics; PRICE: None; PURCHASE-URL: https://pricing.snapeda.com/search/part/STM32L073RZT6/?ref=eda
U3 = PC_Module_SIM7600E-H:SIM7600E-H: Multi-Band LTE-TDD/LTE-FDD/HSPA+ and GSM/GPRS/EDGE module; AVAILABILITY: Unavailable; DESCRIPTION: Multi-Band LTE-TDD/LTE-FDD/HSPA+ and GSM/GPRS/EDGE module; MF: Simcom; MP: SIM7600E-H; PACKAGE: None; PRICE: None
U4 = PC_IC_TXB0104RGYR:TXB0104RGYR: 4-Bit Bidirectional Voltage-Level Shifter with Auto Direction Sensing and +/-15 kV ESD Protect 14-VQFN -40 to 85 Check prices <https://pricing.snapeda.com/parts/TXB0104RGYR/Texas%20Instruments/view-part?ref=eda>; AVAILABILITY: Good; DESCRIPTION: 4-Bit Bidirectional Voltage-Level Shifter with Auto Direction Sensing and +/-15 kV ESD Protect 14-VQFN -40 to 85; MF: Texas Instruments; MP: TXB0104RGYR; PACKAGE: VQFN-14 Texas Instruments; PRICE: None; PURCHASE-URL: https://pricing.snapeda.com/search/part/TXB0104RGYR/?ref=eda
U5 = PC_IC_CP2102-GM:CP2102-GM: IC USB-TO-UART BRIDGE 28VQFN Check prices <https://pricing.snapeda.com/parts/CP2102-GM/Silicon%20Labs/view-part?ref=eda>; AVAILABILITY: Good; DESCRIPTION: USB Bridge, USB to UART USB 2.0 UART Interface 28-QFN (5x5); MF: Silicon Labs; MP: CP2102-GM; PACKAGE: QFN-28 Silicon Labs; PRICE: None; PURCHASE-URL: https://pricing.snapeda.com/search/part/CP2102-GM/?ref=eda
Y1 = PC_Crystal_ABMM2-8.000MHZ-E2-T:ABMM2-8.000MHZ-E2-T: Check prices <https://pricing.snapeda.com/parts/ABMM2-8.000MHZ-E2-T/Abracon/view-part?ref=eda>; AVAILABILITY: Good; DESCRIPTION: 8MHz ±20ppm Crystal 18pF 72 Ohms 4-SMD, No Lead; MF: Abracon; MP: ABMM2-8.000MHZ-E2-T; PACKAGE: SMD-4 Abracon; PRICE: None; PURCHASE-URL: https://pricing.snapeda.com/search/part/ABMM2-8.000MHZ-E2-T/?ref=eda
Y2 = PC_Crystal_ABS07-32.768KHZ-T:ABS07-32.768KHZ-T: ABS07 Series 32.768 kHz ±20 ppm 12.5 pF -40 to +85 °C SMT Low Profile Crystal Check prices <https://pricing.snapeda.com/parts/ABS07-32.768KHZ-T/Abracon/view-part?ref=eda>; AVAILABILITY: Warning; DESCRIPTION: 32.768kHz ±20ppm Crystal 12.5pF 70 kOhms 2-SMD, No Lead; MF: Abracon; MP: ABS07-32.768KHZ-T; PACKAGE: SMD-2 Abracon LLC; PRICE: None; PURCHASE-URL: https://pricing.snapeda.com/search/part/ABS07-32.768KHZ-T/?ref=eda